# Altium schematic sheet MosfetField.SchDoc: MosfetField
size A; Revision: REV1; SheetNumber: 4; SheetTotal: 4
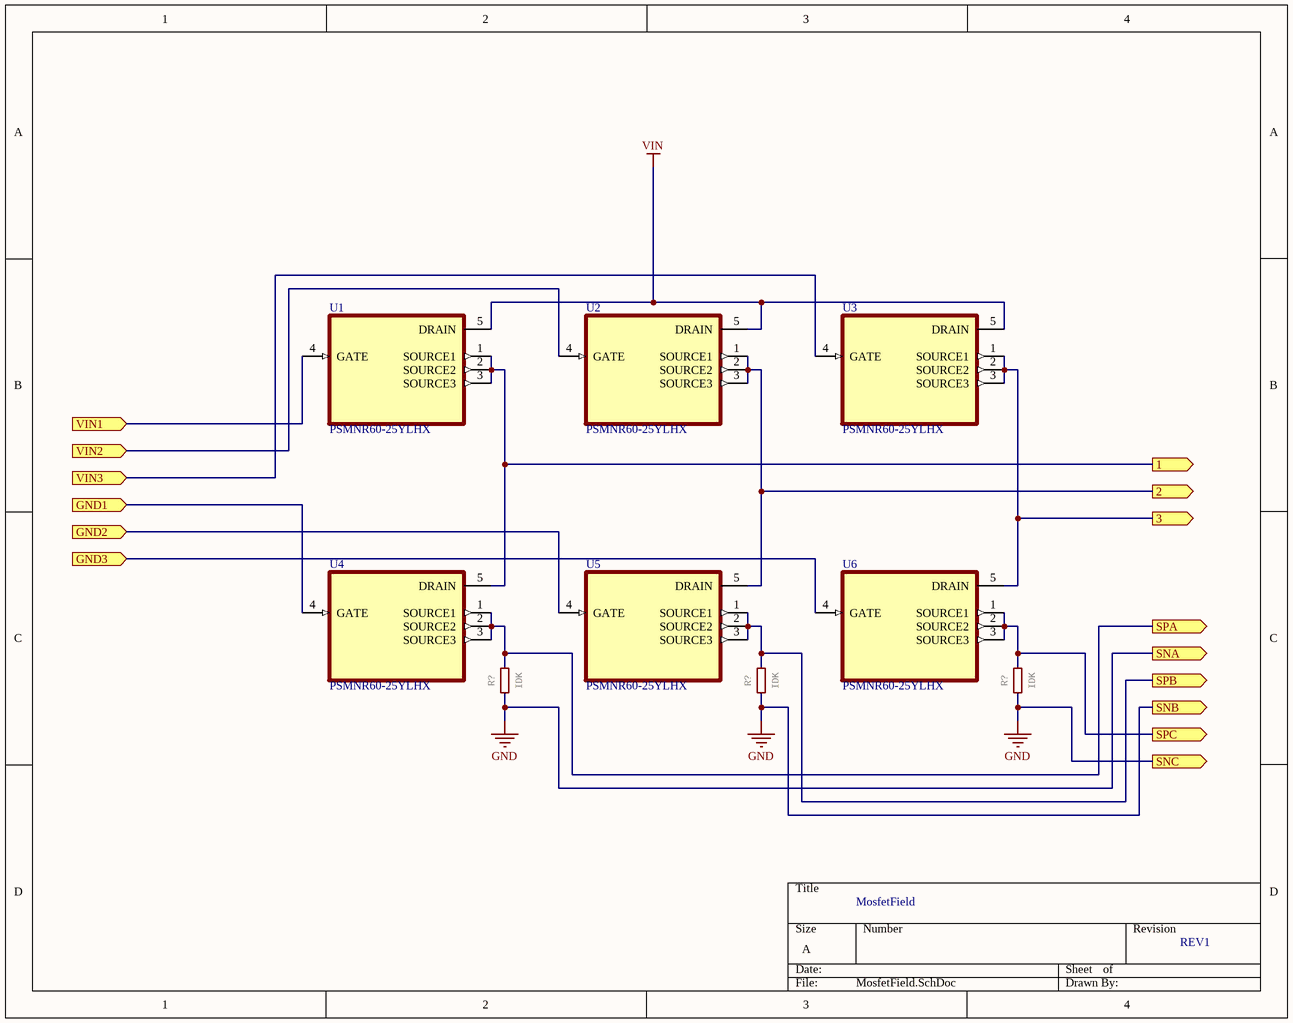
[diagram p0: MosfetField.SchDoc]

## Parts
(Parts that share a designator on the sheet are numbered #1, #2 ... from top to bottom, then left to right.)
R?#1  IDK  [0402-1005X55N]
R?#2  IDK  [0402-1005X55N]
R?#3  IDK  [0402-1005X55N]
U1  PSMNR60-25YLHX  [TO127P600X120-5N]
U2  PSMNR60-25YLHX  [TO127P600X120-5N]
U3  PSMNR60-25YLHX  [TO127P600X120-5N]
U4  PSMNR60-25YLHX  [TO127P600X120-5N]
U5  PSMNR60-25YLHX  [TO127P600X120-5N]
U6  PSMNR60-25YLHX  [TO127P600X120-5N]

## Ports
1 (out), 2 (out), 3 (out), GND1 (in), GND2 (in), GND3 (in), SNA (out), SNB (out), SNC (out), SPA (out), SPB (out), SPC (out), VIN1 (in), VIN2 (in), VIN3 (in)

## Nets
GND: R?#1.1 R?#2.1 R?#3.1 ; port SNA, port SNB, port SNC
VIN: U1.5(DRAIN) U2.5(DRAIN) U3.5(DRAIN)
1: U1.1(SOURCE1) U1.2(SOURCE2) U1.3(SOURCE3) U4.5(DRAIN) ; port 1
2: U2.1(SOURCE1) U2.2(SOURCE2) U2.3(SOURCE3) U5.5(DRAIN) ; port 2
3: U3.1(SOURCE1) U3.2(SOURCE2) U3.3(SOURCE3) U6.5(DRAIN) ; port 3
GND1: U4.4(GATE) ; port GND1
GND2: U5.4(GATE) ; port GND2
GND3: U6.4(GATE) ; port GND3
SPA: R?#1.2 U4.1(SOURCE1) U4.2(SOURCE2) U4.3(SOURCE3) ; port SPA
SPB: R?#2.2 U5.1(SOURCE1) U5.2(SOURCE2) U5.3(SOURCE3) ; port SPB
SPC: R?#3.2 U6.1(SOURCE1) U6.2(SOURCE2) U6.3(SOURCE3) ; port SPC
VIN1: U1.4(GATE) ; port VIN1
VIN2: U2.4(GATE) ; port VIN2
VIN3: U3.4(GATE) ; port VIN3

## Library data of the parts
R?#1-R?#3 = R-0402: SMD Resistor; MANUFACTURER: Yageo; MANUFACTURER-PN: RC0402FR-07330RL; GateName_1: G$1; SymbolName_1: R; DeviceName: -0402; CODE-ARDUINO: 2229; NOTE: NO; LibraryName: Arduino-rcl; DeviceSetName: R; DATASHEET: www.yageo.com.tw/exep/pages/download/literatures/PYu-R_INT-thick_7.pdf; DISTRIBUTOR-LINK: http://www.digikey.com/product-detail/en/yageo/RC0402FR-07330RL/311-330LRCT-ND/729541; DISTRIBUTOR-PN: 311-330LRCT-ND
U1-U6 = PSMNR60-25YLHX: N-Channel 25V 300A (Ta) 268W (Ta) Surface Mount LFPAK56, Power-SO8; MF: Nexperia; MP: PSMNR60-25YLHX; Price: None; SnapEDA_Link: https://www.snapeda.com/parts/PSMNR60-25YLHX/Nexperia/view-part/5062034/?ref=snap; Availability: Warning; Purchase-URL: https://pricing.snapeda.com/search/part/PSMNR60-25YLHX/?ref=eda; Value: *; Check_prices: https://www.snapeda.com/parts/PSMNR60-25YLHX/Nexperia/view-part/5062034/?ref=eda; Package: LFPAK56-4 Nexperia USA Inc.